# Altium schematic sheet flow.SchDoc
size A4; SheetNumber: 2; SheetTotal: 3
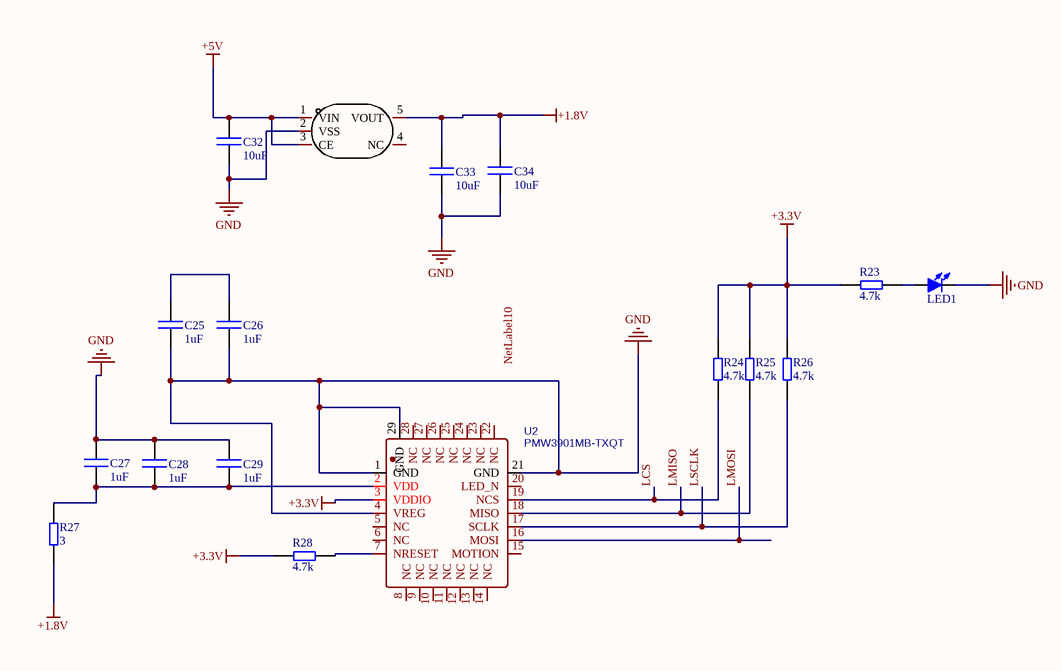
[diagram p0: flow.SchDoc]

## Parts
C25  Cap  [Cap]  (value not drawn)
C26  Cap  [Cap]  (value not drawn)
C27  Cap  [Cap]  (value not drawn)
C28  Cap  [Cap]  (value not drawn)
C29  Cap  [Cap]  (value not drawn)
C32  Cap  [Cap]  (value not drawn)
C33  Cap  [Cap]  (value not drawn)
C34  Cap  [Cap]  (value not drawn)
LED1  LED  [LED-0603]  (value not drawn)
R23  4.7K  [RES-0603]
R24  4.7K  [RES-0603]
R25  4.7K  [RES-0603]
R26  4.7K  [RES-0603]
R27  3  [RES-0603]
R28  4.7K  [RES-0603]
U2  PMW3901MB-TXQT  [COB-28_L6.0-W6.0-P0.65-TL-EP]
U4  ME6214C18M5G  [SOT-23-5_L3.0-W1.7-P0.95-LS2.8-BR]  (value not drawn)

## Nets
+1.8V: C33.2 C34.2 R27.2 U4.5(VOUT)
+3.3V: R23.1 R24.2 R25.2 R26.2 R28.2 U2.3(VDDIO)
+5V: C32.2 U4.1(VIN) U4.3(CE)
GND: C25.1 C26.1 C27.2 C28.2 C29.2 C32.1 C33.1 C34.1 LED1.2 U2.1(GND) U2.4(VREG) U2.21(GND) U2.29(GND) U4.2(VSS)
LCS: R24.1 U2.19(NCS)
LMISO: R25.1 U2.18(MISO)
LMOSI: U2.16(MOSI)
LSCLK: R26.1 U2.17(SCLK)
NetC25_2: C25.2 C26.2
NetC27_1: C27.1 C28.1 C29.1 R27.1 U2.2(VDD)
NetLED1_1: LED1.1 R23.2
NetR28_1: R28.1 U2.7(NRESET)

Not connected (* = marked no-connect by the designer): U2 5(NC) 6(NC) 8(NC) 9(NC) 10(NC) 11(NC) 12(NC) 13(NC) 14(NC) 15(MOTION) 20(LED_N) 22(NC) 23(NC) 24(NC) 25(NC) 26(NC) 27(NC) 28(NC); U4 4(NC)

## Notes on the sheet
- Labels drawn without touching a wire or pin: NetLabel10
- (in symbol Cap) 1uF; 10uF
- (in symbol RES) 4.7k

## Library data of the parts
R23-R28 = RES
U2 = PMW3901MB-TXQT: Manufacturer: null; Contributor: lcsc; Supplier: LCSC; Supplier Part: C9900000235; Manufacturer Part: PMW3901MB-TXQT; JLCPCB Part Class: Extended Part; spicePre: U; spiceSymbolName: PMW3901MB-TXQT
U4 = ME6214C18M5G: Manufacturer: MICRONE(南京微盟); Add into BOM: yes; Output Type: 固定; Output Polarity: 正; Number of Outputs: 1; Maximum Input Voltage: 18V; Output Voltage: 1.8V; Dropout Voltage: 600mV@(200mA); Output Current: 300mA; Name: ME6214C18M5G; Symbol: ME6214C18M5G; Device: ME6214C18M5G; LCSC Part Name: 输入18V 输出1.8V 300mA; Supplier Part: C236665; Manufacturer Part: ME6214C18M5G; Supplier Footprint: SOT-23-5; JLCPCB Part Class: Extended Part; Datasheet: https://atta.szlcsc.com/upload/public/pdf/source/20190628/C76500_8C40FD23FABB9ADD019D3F4B42283547.pdf; Supplier: LCSC; Convert to PCB: yes; Power Supply Rejection Ratio (PSRR): -